# EAGLE design RollerShutterNode_smdnrf (EAGLE 6.5.0)
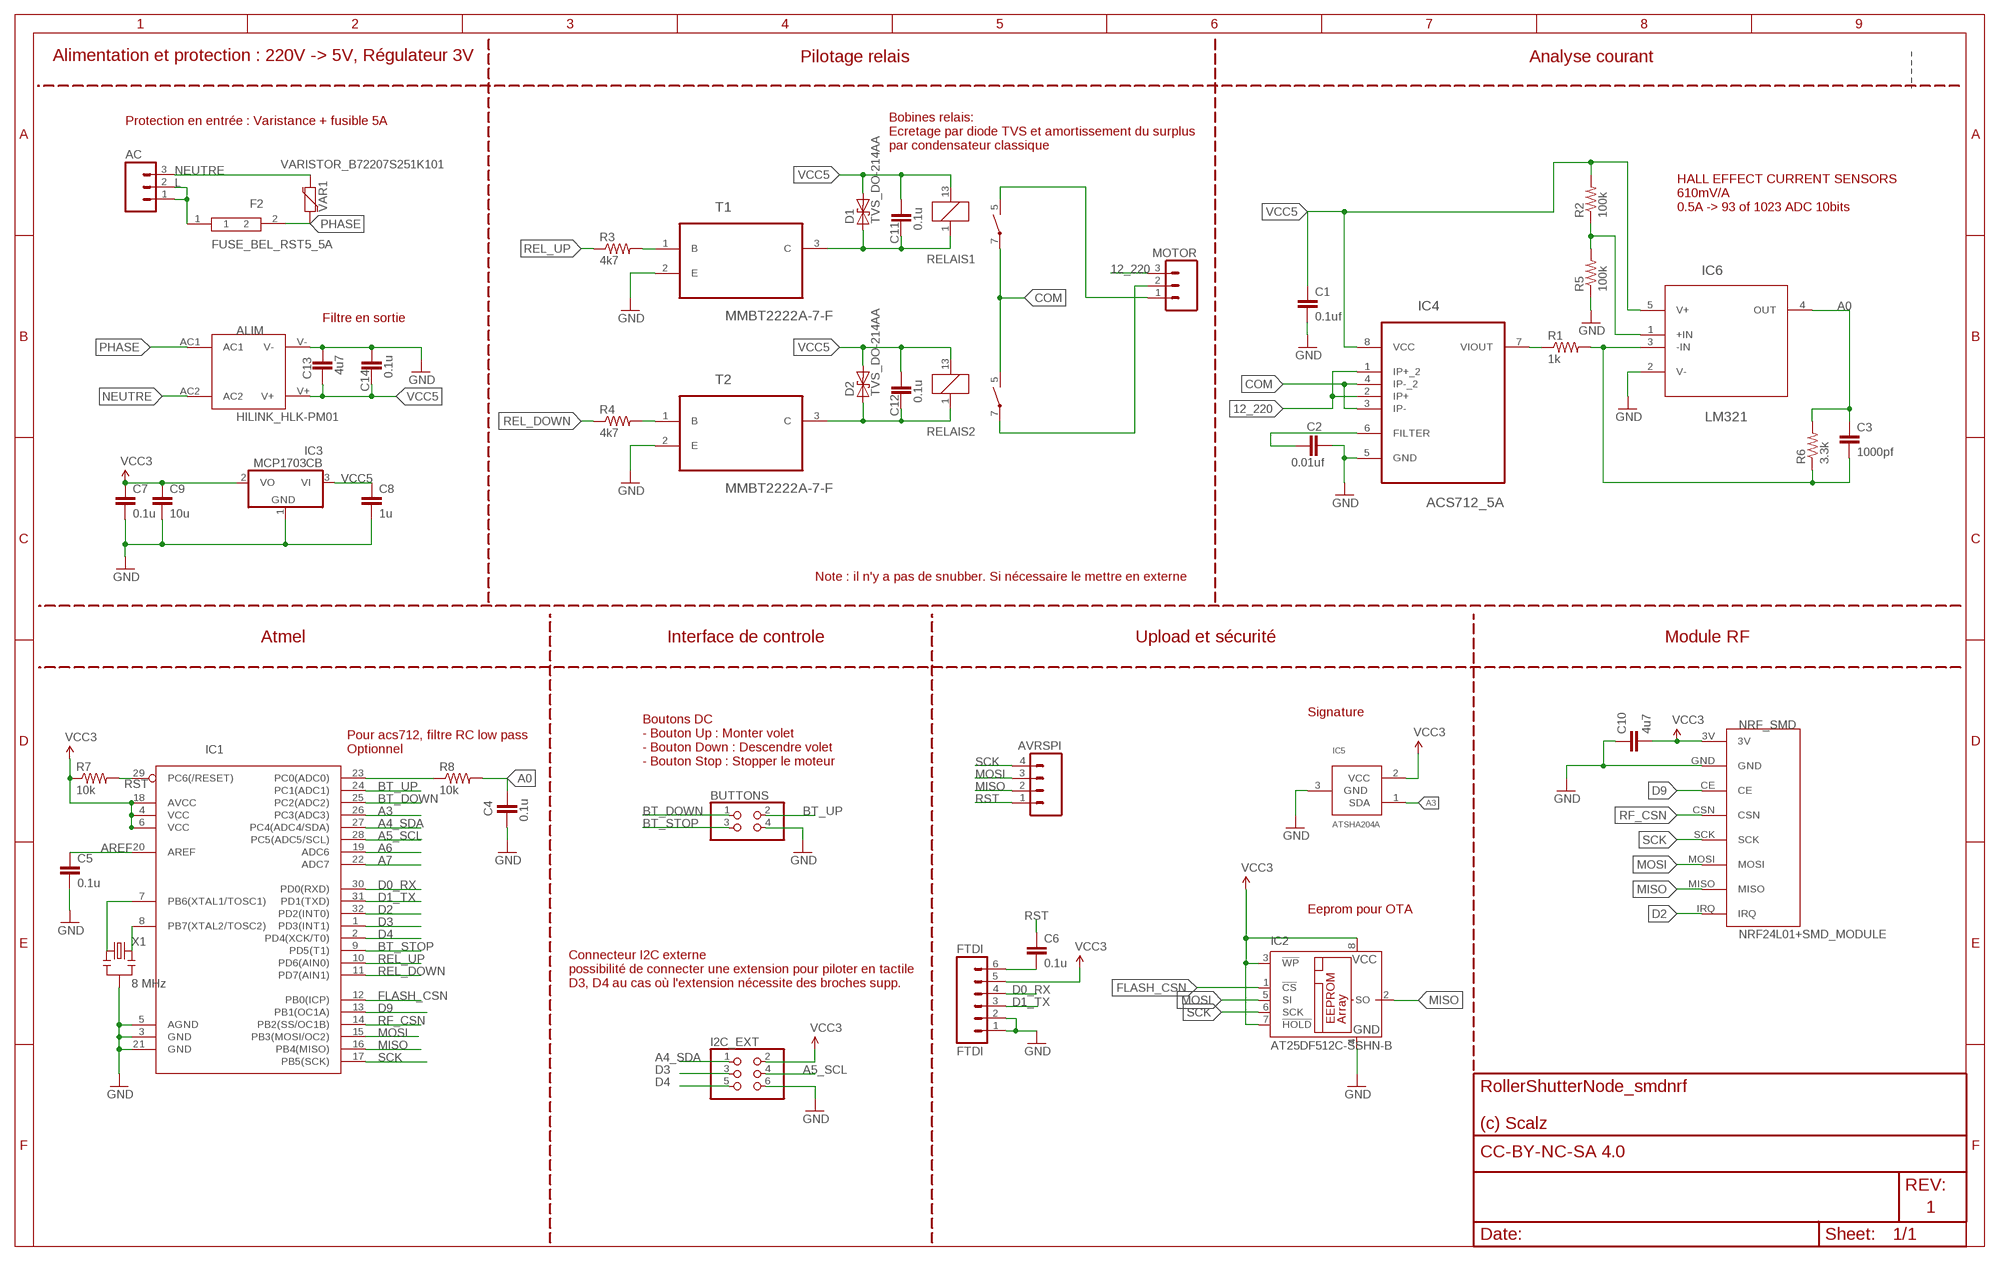
[diagram p0: schematic, sheet 1]

## Parts
AC  M03-SCREW-5MM  [SCREWTERMINAL-5MM-3]
ALIM  HILINK_HLK-PM01  [HILINK_HLK-PM01]
AVRSPI  M04PTH  [1X04]
BUTTONS  PINHD-2X2  [2X02]
C1  0.1uf  CAP0805-CAP  [0805-CAP]
C2  0.01uf  CAP0805-CAP  [0805-CAP]
C3  1000pf  CAP0805-CAP  [0805-CAP]
C4  0.1u  CAP0805-CAP  [0805-CAP]
C5  0.1u  CAP0805-CAP  [0805-CAP]
C6  0.1u  CAP0805-CAP  [0805-CAP]
C7  0.1u  CAP0805-CAP  [0805-CAP]
C8  1u  CAP0805-CAP  [0805-CAP]
C9  10u  CAP0805-CAP  [0805-CAP]
C10  4u7  CAP0805-CAP  [0805-CAP]
C11  0.1u  CAP0805-CAP  [0805-CAP]
C12  0.1u  CAP0805-CAP  [0805-CAP]
C13  4u7  CAP0805-CAP  [0805-CAP]
C14  0.1u  CAP0805-CAP  [0805-CAP]
D1  TVS_DO-214AA  [TVS_DO-214AA]
D2  TVS_DO-214AA  [TVS_DO-214AA]
F2  FUSE_BEL_RST5_5A  [FUSE_BEL_RST5_5A]
FTDI  FTDI  M06SIP  [1X06]
I2C_EXT  PINHD-2X3  [2X03]
IC1  ATMega-328  ATMEGA168/328TQFP32  [TQFP32-08]
IC2  AT25DF512C-SSHN-B  25AA080SN  [SO-08]
IC3  MCP1703CB  [SOT23]
IC4  ACS712_5A  ACS712ELCTR-20A-T  [SOIC127P600X175-8N]
IC5  ATSHA204A  [SOT23]
IC6  LM321  LM321MF  [SOT95P285X120-5N]
MOTOR  M03-SCREW-5MM  [SCREWTERMINAL-5MM-3]
NRF_SMD  NRF24L01+SMD_MODULE  [NRF24L01+SMD_MODULE]
R1  1k  RESISTOR0805-RES  [0805-RES]
R2  100k  RESISTOR0805-RES  [0805-RES]
R3  4k7  RESISTOR0805-RES  [0805-RES]
R4  4k7  RESISTOR0805-RES  [0805-RES]
R5  100k  RESISTOR0805-RES  [0805-RES]
R6  3.3k  RESISTOR0805-RES  [0805-RES]
R7  10k  RESISTOR0805-RES  [0805-RES]
R8  10k  RESISTOR0805-RES  [0805-RES]
RELAIS1  Relais G6D  G6D-1A-ASI12VDC  [G6D]
RELAIS2  Relais G6D  G6D-1A-ASI12VDC  [G6D]
T1  MMBT2222A-7-F  [SOT103P240X110-3N]
T2  MMBT2222A-7-F  [SOT103P240X110-3N]
VAR1  VARISTOR_B72207S251K101  [VARISTOR_B72207S251K101]
X1  8 MHz  RESONATORSMD  [RESONATOR-SMD]

## Nets
12_220: IC4.1(IP+_2) IC4.2(IP+) MOTOR.3
A0: C3.1 C4.2 IC6.4(OUT) R6.2 R8.2
A3: IC1.26(PC3(ADC3)) IC5.1(SDA)
A4_SDA: I2C_EXT.1 IC1.27(PC4(ADC4/SDA))
A5_SCL: I2C_EXT.4 IC1.28(PC5(ADC5/SCL))
A6: IC1.19(ADC6)
A7: IC1.22(ADC7)
AREF: C5.1 IC1.20(AREF)
BT_DOWN: BUTTONS.1 IC1.25(PC2(ADC2))
BT_STOP: BUTTONS.3 IC1.9(PD5(T1))
BT_UP: BUTTONS.2 IC1.24(PC1(ADC1))
COM: IC4.3(IP-) IC4.4(IP-_2) RELAIS1.7(2:P) RELAIS2.5(2:S)
D0_RX: FTDI.4 IC1.30(PD0(RXD))
D1_TX: FTDI.3 IC1.31(PD1(TXD))
D2: IC1.32(PD2(INT0)) NRF_SMD.IRQ
D3: I2C_EXT.3 IC1.1(PD3(INT1))
D4: I2C_EXT.5 IC1.2(PD4(XCK/T0))
D9: IC1.13(PB1(OC1A)) NRF_SMD.CE
FLASH_CSN: IC1.12(PB0(ICP)) IC2.1(!CS)
GND: ALIM.V- BUTTONS.4 C1.2 C2.2 C4.1 C5.2 C7.2 C8.2 C9.2 C10.1 C13.2 C14.2 FTDI.1 FTDI.2 I2C_EXT.6 IC1.3(GND) IC1.5(AGND) IC1.21(GND) IC2.4(GND) IC3.1(GND) IC4.5(GND) IC5.3(GND) IC6.2(V-) NRF_SMD.GND R5.1 T1.2(E) T2.2(E) X1.2
L: AC.1 AC.2 F2.1
MISO: AVRSPI.2 IC1.16(PB4(MISO)) IC2.2(SO) NRF_SMD.MISO
MOSI: AVRSPI.3 IC1.15(PB3(MOSI/OC2)) IC2.5(SI) NRF_SMD.MOSI
N$1: C2.1 IC4.6(FILTER)
N$3: IC4.7(VIOUT) R1.1
N$4: R3.2 T1.1(B)
N$5: R4.2 T2.1(B)
N$6: C12.1 D2.A RELAIS2.1 T2.3(C)
N$7: MOTOR.1 RELAIS1.5(2:S)
N$8: C11.1 D1.A RELAIS1.1 T1.3(C)
N$9: MOTOR.2 RELAIS2.7(2:P)
N$10: C3.2 IC6.3(-IN) R1.2 R6.1
N$11: IC6.1(+IN) R2.1 R5.2
N$12: IC1.7(PB6(XTAL1/TOSC1)) X1.1
N$16: IC1.23(PC0(ADC0)) R8.1
N$20: C6.2 FTDI.6
N$21: IC1.8(PB7(XTAL2/TOSC2)) X1.3
NEUTRE: AC.3 ALIM.AC2 VAR1.1
PHASE: ALIM.AC1 F2.2 VAR1.2
REL_DOWN: IC1.11(PD7(AIN1)) R4.1
REL_UP: IC1.10(PD6(AIN0)) R3.1
RF_CSN: IC1.14(PB2(SS/OC1B)) NRF_SMD.CSN
RST: AVRSPI.1 C6.1 IC1.29(PC6(/RESET)) R7.2
SCK: AVRSPI.4 IC1.17(PB5(SCK)) IC2.6(SCK) NRF_SMD.SCK
VCC: C7.1 C9.1 C10.2 FTDI.5 I2C_EXT.2 IC1.4(VCC) IC1.6(VCC) IC1.18(AVCC) IC2.3(!WP) IC2.7(!HOLD) IC2.8(VCC) IC3.2(VO) IC5.2(VCC) NRF_SMD.3V R7.1 ; supply symbol labelled VCC3
VCC5: ALIM.V+ C1.1 C8.1 C11.2 C12.2 C13.1 C14.1 D1.C D2.C IC3.3(VI) IC4.8(VCC) IC6.5(V+) R2.2 RELAIS1.13 RELAIS2.13

## Notes on the sheet
- Alimentation et protection : 220V -> 5V, Régulateur 3V | Pilotage relais | Analyse courant
- Protection en entrée : Varistance + fusible 5A
- Bobines relais:
  Ecretage par diode TVS et amortissement du surplus
  par condensateur classique
- HALL EFFECT CURRENT SENSORS
  610mV/A
  0.5A -> 93 of 1023 ADC 10bits
- Filtre en sortie
- Note : il n'y a pas de snubber. Si nécessaire le mettre en externe
- Atmel | Interface de controle | Upload et sécurité | Module RF
- Signature
- Pour acs712, filtre RC low pass
  Optionnel
- Boutons DC
  - Bouton Up : Monter volet
  - Bouton Down : Descendre volet
  - Bouton Stop : Stopper le moteur
- Eeprom pour OTA
- Connecteur I2C externe
  possibilité de connecter une extension pour piloter en tactile
  D3, D4 au cas où l'extension nécessite des broches supp.

## Library data of the parts
AC MOTOR = SparkFun-Connectors:M03: Header 3 Standard 3-pin 0.1" header. Use with straight break away headers (SKU : PRT-00116), right angle break away headers (PRT-00553), swiss pins (PRT-00743), machine pins (PRT-00117), and female headers (PRT-00115). Molex polarized connector foot print use with SKU : PRT-08232 with associated crimp pins and housings.
ALIM = pmo_lib:HILINK_HLK-PM01
AVRSPI = SparkFun-Connectors:M04: Header 4 Standard 4-pin 0.1" header. Use with straight break away headers (SKU : PRT-00116), right angle break away headers (PRT-00553), swiss pins (PRT-00743), machine pins (PRT-00117), and female headers (PRT-00115). Molex polarized connector foot print use with SKU : PRT-08231 with associated crimp pins and housings. 1MM SMD Version SKU: PRT-10208
BUTTONS = pinhead:PINHD-2X2: PIN HEADER
C1-C14 = LowPowerLab:CAP: Capacitor Standard 0603 ceramic capacitor, and 0.1" leaded capacitor.
D1 D2 = pmo_lib:TVS_DO-214AA
F2 = pmo_lib:FUSE_BEL_RST5_5A
FTDI = SparkFun-Connectors:M06: Header 6 Standard 6-pin 0.1" header. Use with straight break away headers (SKU : PRT-00116), right angle break away headers (PRT-00553), swiss pins (PRT-00743), machine pins (PRT-00117), and female headers (PRT-00115). Molex polarized connector foot print use with SKU : PRT-08094 with associated crimp pins and housings. NOTES ON THE VARIANTS LOCK and LOCK_LONGPADS... This footprint was designed to help hold the alignment of a through-hole component (i.e. 6-pin header) while soldering it into place. You may notice that each hole has been shifted either up or down by 0.005 of an inch from it's more standard position (which is a perfectly straight line). This slight alteration caused the pins (the squares in the middle) to touch the edges of the holes. Because they are alternating, it causes a "brace" to hold the component in place. 0.005 has proven to be the perfect amount of "off-center" position when using our standard breakaway headers. Although looks a little odd when you look at the bare footprint, once you have a header in there, the alteration is very hard to notice. Also, if you push a header all the way into place, it is covered up entirely on the bottom side. This idea of altering the position of holes to aid alignment will be further integrated into the Sparkfun Library for other footprints. It can help hold any component with 3 or more connection pins.
I2C_EXT = pinhead:PINHD-2X3: PIN HEADER
IC1 = LowPowerLab:ATMEGA168/328: Atmel 32-pin 8-bit micro, 16k flash.; EAGLEUP: TQFP32-08
IC2 = microchip:25*: Serial EEPROM 4K/ 8K , SPI bus; MF: MICROCHIP; MPN: 25AA080/SN; OC_FARNELL: 1816072; OC_NEWARK: 92C7351
IC3 = linear:MCP1703: 250 mA, 16V, Low Quiescent Current LDO Regulator Source: http://ww1.microchip.com/downloads/en/DeviceDoc/22049b.pdf
IC4 = pmo_lib:ACS712ELCTR-20A-T: Linear Current Sensor; MPN: ACS712ELCTR-20A-T; OC_FARNELL: 1329624; OC_NEWARK: 31M3133; PACKAGE: SOIC-8; SUPPLIER: Allegro
IC5 = Sensor_tbowmo:ATSHA204A
IC6 = pmo_lib:LM321MF: Low Power Single Op Amp; MPN: LM321MF; OC_FARNELL: 9779116; OC_NEWARK: 37K8530; PACKAGE: SOT-23-5; SUPPLIER: National Semiconductors
NRF_SMD = pmo_lib:NRF24L01+SMD_MODULE
R1-R8 = LowPowerLab:RESISTOR: Resistor Basic schematic elements and footprints for 0603, 1206, and PTH resistors.
RELAIS1 RELAIS2 = relay:G6D?*: OMRON Slim, Miniature PCB Relay 17.5 × 6.5 × 12.5 mm with Socked Source: http://ecb.omron.com.sg/pdf/relay/power/G6D.pdf
T1 T2 = pmo_lib:MMBT2222A-7-F: NPN SMALL SIGNAL SURFACE MOUNT TRANSISTOR; MPN: MMBT2222A-7-F; OC_FARNELL: 1773626; OC_NEWARK: 51R6809; PACKAGE: SOT-23-3; SUPPLIER: DIODES INC.
VAR1 = pmo_lib:VARISTOR_B72207S251K101
X1 = SparkFun:RESONATOR: Resonator Small SMD resonator. This is the itty bitty 10/20MHz resonators with built in caps. CSTCE10M0G55 and CSTCE20M0V53. Footprint has been reviewed closely but hasn't been tested yet.

## Net classes
1 Power: width 0.406 mm

## Board
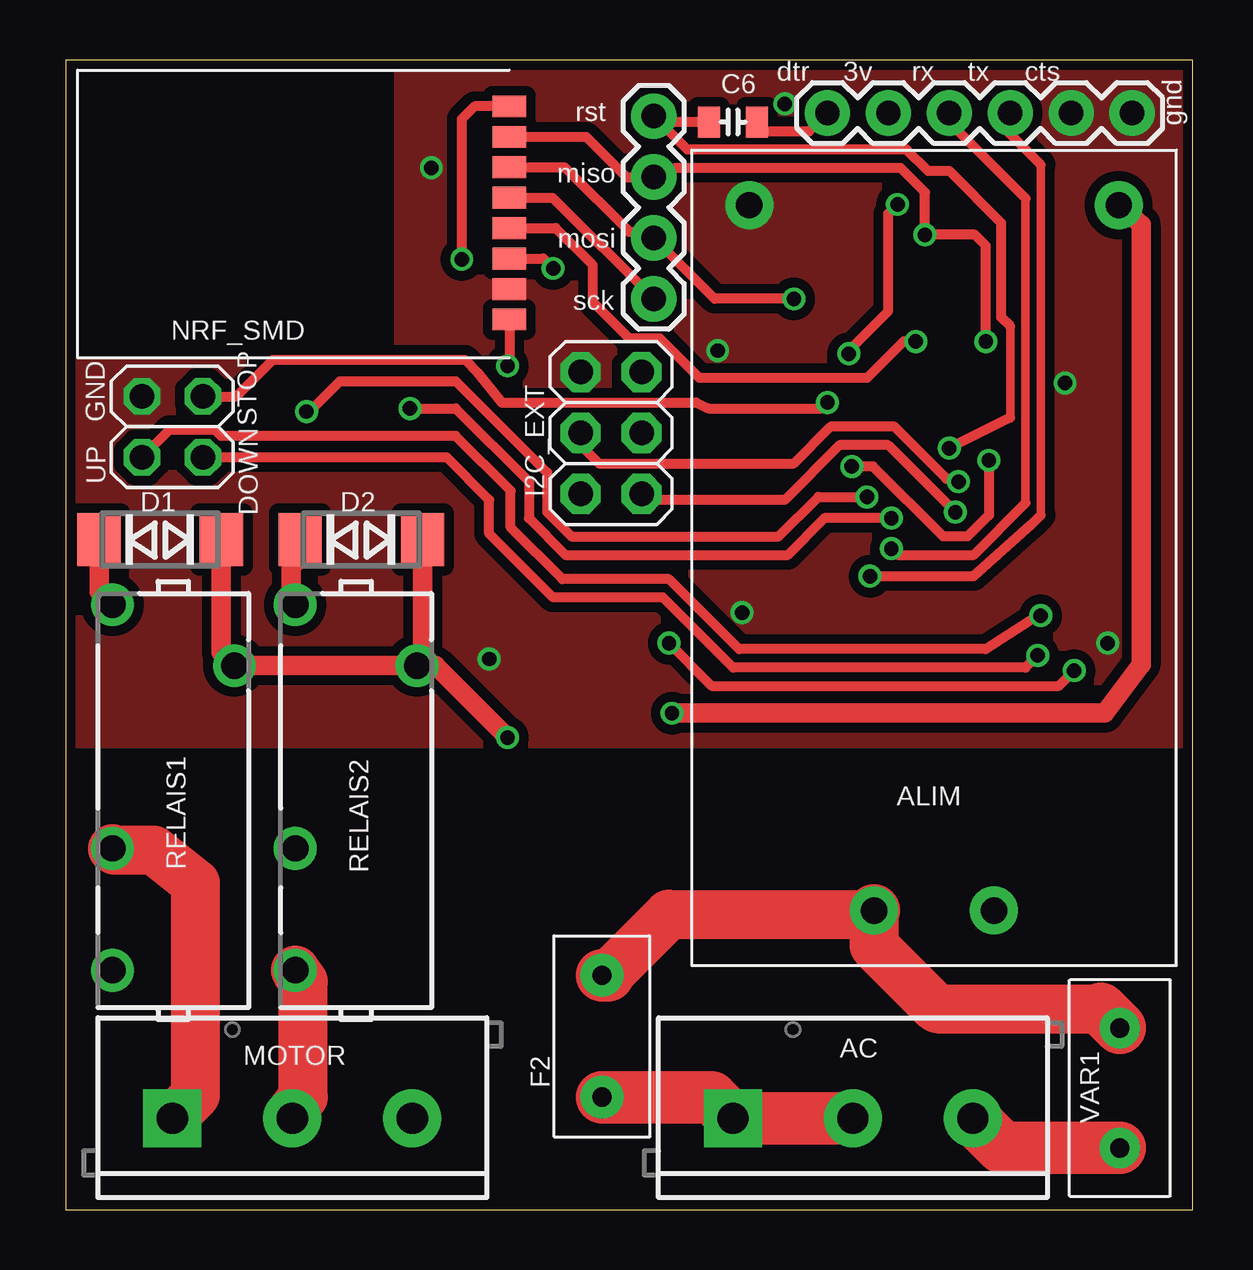
[diagram p1: board, top side]
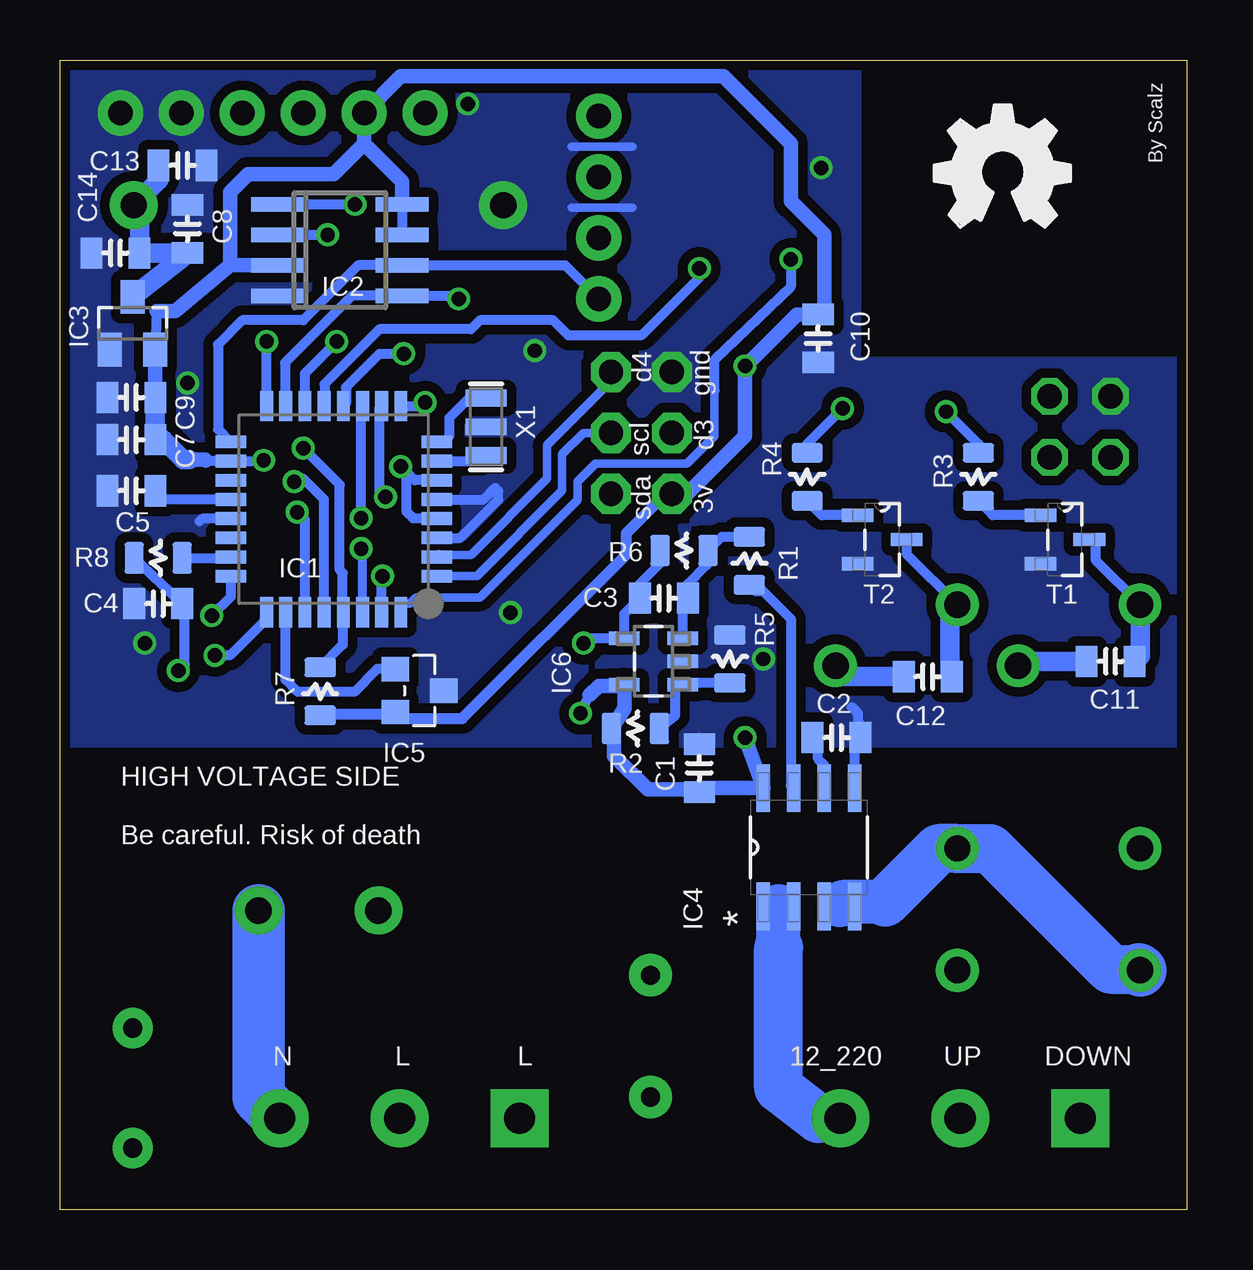
[diagram p2: board, bottom side, seen from below]

Size 46.97 x 47.93 mm. Coordinates in mm from the lower left corner, seen from the top.
Outline: 0,0 46.97,0 46.97,47.93 0,47.93 0,0
Copper layers (1*16): Top 0.0356mm / dielectric 1.5011mm / Bottom 0.0356mm
Design rules "LaenPCBOrder": minimum track width 6mil, minimum drill 13mil, track to track 6mil, track to pad 6mil, pad to pad 6mil, via to via 6mil, smd to smd 6mil, copper to edge 15mil, drill to drill 6mil, minimum pad ring 7mil, minimum via ring 7mil, stop-mask expansion 3mil, vias tented up to drill 0mil, thermal gap 10mil

### Footprints (pad centres in the part's own frame; a part is rotated, then mirrored left to right if it is on the bottom)
SCREWTERMINAL-5MM-3 = drill 1.3 pad 2.413 square: 1 0,0 | drill 1.3 pad 2.413: 2 5,0; 3 10,0
HILINK_HLK-PM01 = drill 1.1 pad 2: AC1 2.5,14.7; AC2 -2.5,14.7; V+ -7.7,-14.7; V- 7.7,-14.7
1X04 = drill 1.016 pad 1.88: 1 0,0; 2 2.54,0; 3 5.08,0; 4 7.62,0
2X02 = drill 1.016 octagon: 1 -1.27,-1.27; 2 -1.27,1.27; 3 1.27,-1.27; 4 1.27,1.27
0805-CAP = smd 0.902 x 1.3: 1 -1,0; 2 1,0
TVS_DO-214AA = smd 1.8 x 2.2: A 2.55,0; C -2.55,0
FUSE_BEL_RST5_5A = drill 0.8 pad 1.778: 1 -2.54,0; 2 2.54,0
1X06 = drill 1.016 pad 1.88: 1 0,0; 2 2.54,0; 3 5.08,0; 4 7.62,0; 5 10.16,0; 6 12.7,0
2X03 = drill 1.016 pad 1.676 octagon: 1 -2.54,-1.27; 2 -2.54,1.27; 3 0,-1.27; 4 0,1.27; 5 2.54,-1.27; 6 2.54,1.27
TQFP32-08 = smd 1.27 x 0.533: 1 -4.293,2.8; 2 -4.293,2; 3 -4.293,1.2; 4 -4.293,0.4; 5 -4.293,-0.4; 6 -4.293,-1.2; 7 -4.293,-2; 8 -4.293,-2.8; 17 4.293,-2.8; 18 4.293,-2; 19 4.293,-1.2; 20 4.293,-0.4; 21 4.293,0.4; 22 4.293,1.2; 23 4.293,2; 24 4.293,2.8 | smd 0.533 x 1.27: 9 -2.8,-4.293; 10 -2,-4.293; 11 -1.2,-4.293; 12 -0.4,-4.293; 13 0.4,-4.293; 14 1.2,-4.293; 15 2,-4.293; 16 2.8,-4.293; 25 2.8,4.293; 26 2,4.293; 27 1.2,4.293; 28 0.4,4.293; 29 -0.4,4.293; 30 -1.2,4.293; 31 -2,4.293; 32 -2.8,4.293
SO-08 = smd 0.6 x 2.2: 1 -1.905,-2.6; 2 -0.635,-2.6; 3 0.635,-2.6; 4 1.905,-2.6; 5 1.905,2.6; 6 0.635,2.6; 7 -0.635,2.6; 8 -1.905,2.6
SOT23 = smd 1 x 1.4: 1 -0.95,-1.1; 2 0.95,-1.1; 3 0,1.1
SOIC127P600X175-8N = smd 1.981 x 0.559: 1 -2.464,1.905; 2 -2.464,0.635; 3 -2.464,-0.635; 4 -2.464,-1.905; 5 2.464,-1.905; 6 2.464,-0.635; 7 2.464,0.635; 8 2.464,1.905
SOT23' = smd 1.016 x 1.143: 1 -0.889,-1.016; 2 0.889,-1.016; 3 0,1.016
SOT95P285X120-5N = smd 1.27 x 0.559: 1 -1.219,0.965; 2 -1.219,0; 3 -1.219,-0.965; 4 1.219,-0.965; 5 1.219,0.965
NRF24L01+SMD_MODULE = smd 0.9 x 1.4: 3V -4.8,-9.6; CE -2.26,-9.6; CSN -0.99,-9.6; GND -3.53,-9.6; IRQ 4.09,-9.6; MISO 2.82,-9.6; MOSI 1.55,-9.6; SCK 0.28,-9.6
0805-RES = smd 0.8 x 1.3: 1 -1,0; 2 1,0
G6D = drill 1.1 pad 1.778: 1 8.08,2.5; 5 -2.08,2.5; 7 -7.16,2.5; 13 5.54,-2.58
SOT103P240X110-3N = smd 1.321 x 0.559: 1 -1.016,1.016; 2 -1.016,-1.016; 3 1.016,0
VARISTOR_B72207S251K101 = drill 0.8 pad 1.676: 1 -2.5,0; 2 2.5,0
RESONATOR-SMD = smd 0.7 x 1.7: 1 -1.2,0; 2 0,0; 3 1.2,0

### Placement (x,y rotation side)
AC  27.81,3.81 0 top
ALIM  36.2,27.18 180 top
AVRSPI  24.51,45.59 270 top
BUTTONS  4.45,32.64 90 top
C1  20.32,18.41 90 bottom
C2  14.61,19.68 0 bottom
C3  21.79,25.5 0 bottom
C4  42.88,25.27 0 bottom
C5  43.99,29.97 180 bottom
C6  27.81,45.34 0 top
C7  43.99,32.11 180 bottom
C8  41.66,40.89 90 bottom
C9  43.99,33.86 180 bottom
C10  15.37,36.32 90 bottom
C11  3.17,22.86 180 bottom
C12  10.79,22.23 180 bottom
C13  41.86,43.54 0 bottom
C14  44.65,39.88 180 bottom
D1  3.94,27.94 180 top
D2  12.32,27.94 180 top
F2  22.35,7.24 90 top
FTDI  44.45,45.72 180 top
I2C_EXT  22.73,32.38 90 top
IC1  35.56,29.21 180 bottom
IC2  35.31,40.01 270 bottom
IC3  43.94,36.96 0 bottom
IC4  15.75,15.11 90 bottom
IC5  ATSHA204A  [SOT23']  31.98,21.64 270 bottom
IC6  22.23,22.86 180 bottom
MOTOR  4.45,3.81 0 top
NRF_SMD  8.89,41.91 90 top
R1  18.24,27.05 90 bottom
R2  22.99,20.07 180 bottom
R3  8.69,30.56 270 bottom
R4  15.82,30.56 270 bottom
R5  19.05,22.96 270 bottom
R6  20.95,27.48 180 bottom
R7  36.12,21.62 90 bottom
R8  42.88,27.18 180 bottom
RELAIS1  4.45,17.14 90 top
RELAIS2  12.06,17.14 90 top
T1  5.08,27.94 0 bottom
T2  12.7,27.94 0 bottom
U$4  [OSHW_FILLX200_NOTEXT]  10.52,40.97 0 bottom
VAR1  43.94,5.08 90 top
X1  29.21,32.64 90 bottom

### Tracks (layer width: path | path; a pad name or v marks a point on that pad's centre or on a via)
12_220
  Bottom 0.406: IC4.1 17.02,12.65 IC4.2
  Bottom 1.829: 17.02,10.92 17.02,12.65
  Bottom 2.032: MOTOR.3 15.37,3.81 17.02,5.08 17.02,10.92
A0  (via drill 0.6)
  Top 0.406: v25.15,23.62 26.92,21.84 41.4,21.84 v42.04,22.48
  Bottom 0.406: v25.15,23.62 24.94,23.82 IC6.4 23.44,24.85 C3.1 22.79,26.1 21.97,26.92 21.97,27.47 R6.2 | v42.04,22.48 41.77,22.74 41.77,25.15 C4.2 41.98,25.38 R8.2
A3
  Bottom 0.406: 37.59,24.89 IC1.26 37.57,22.1 37.06,21.59 34.7,21.59 33.73,22.55 33.02,22.55 IC5.1
A4_SDA  (via drill 0.6)
  Top 0.406: v37.08,29.08 34.29,31.88 32.26,31.88 29.97,29.59 24.26,29.59 I2C_EXT.1
  Bottom 0.406: IC1.27 36.76,28.76 v37.08,29.08
A5_SCL  (via drill 0.6)
  Top 0.406: v37.21,30.35 37.08,30.48 36.7,30.48 34.54,32.64 31.88,32.64 30.35,31.11 22.23,31.11 21.46,31.88 I2C_EXT.4
  Bottom 0.406: IC1.28 35.96,29.61 36.83,30.48 v37.21,30.35
AREF
  Bottom 0.406: IC1.20 42.83,29.61 C5.1
BT_DOWN  (via drill 0.6)
  Top 0.406: BUTTONS.1 15.88,31.37 17.65,29.59 17.65,28.19 20.32,25.53 24.89,25.53 27.81,22.61 40.01,22.61 v40.51,23.11
  Bottom 0.406: IC1.25 38.36,24.5 38.49,24.5 39.88,23.11 v40.51,23.11
BT_STOP  (via drill 0.6)
  Top 0.406: BUTTONS.3 7.11,33.91 8.64,35.43 16.64,35.43 17.14,34.92 18.16,33.66 26.29,33.66 26.8,33.4 31.5,33.4 v31.75,33.66
  Bottom 0.406: IC1.9 31.9,33.5 v31.75,33.66
BT_UP  (via drill 0.6)
  Top 0.406: BUTTONS.2 4.32,32.51 6.22,32.51 6.48,32.26 16.26,32.26 18.54,29.97 18.54,28.45 20.7,26.29 25.15,26.29 28.07,23.37 38.35,23.37 40.51,24.77 v40.64,24.77
  Bottom 0.406: IC1.24 39.85,25.55 v40.64,24.77
COM
  Bottom 0.406: IC4.3 IC4.4 14.02,12.83 14.35,12.83
  Bottom 1.829: 12.57,12.83 14.35,12.83 14.48,12.7
  Bottom 2.032: 12.57,12.83 10.34,15.06 RELAIS2.5 8.21,15.06 3.17,10.03 1.99,10.03
  Bottom 2.184: 1.99,10.03 RELAIS1.7
D0_RX  (via drill 0.6)
  Top 0.356: 40.01,42.16 40.01,29.46
  Top 0.406: 40.01,29.46 37.85,27.3 34.67,27.3 v34.42,27.56 | 40.01,42.16 36.96,45.21 36.96,45.59 FTDI.4
  Bottom 0.381: IC1.30 34.36,27.5
  Bottom 0.406: 34.36,27.5 v34.42,27.56
D1_TX  (via drill 0.6)
  Top 0.356: 40.64,28.96 40.64,43.56
  Top 0.406: v33.53,26.42 37.85,26.42 40.26,28.57 40.64,28.96 | 40.64,43.56 39.24,44.96 39.24,45.72 FTDI.3
  Bottom 0.406: IC1.31 33.56,26.32 v33.53,26.42
D2  (via drill 0.6)
  Top 0.406: NRF_SMD.IRQ 17.04,46 16.51,45.47 v16.51,39.62
  Bottom 0.356: 32.76,25.28 32.38,25.28 32.13,25.53 29.46,25.53 25.4,29.59 25.4,30.35 24.64,31.11 20.83,31.11 19.68,32.26 19.68,34.16
  Bottom 0.406: IC1.32 32.76,25.28 | 19.68,34.16 19.68,35.43 16.51,38.48 v16.51,39.62
D3
  Bottom 0.356: IC1.1 29.59,26.42 26.04,29.97 26.04,31.5 25.15,32.38 I2C_EXT.3
  Bottom 0.406: IC1.1
D4
  Bottom 0.356: 31.17,27.3 29.84,27.3 26.67,30.48 26.67,31.88 24,34.54 I2C_EXT.5
  Bottom 0.406: 31.17,27.3 IC1.2
D9  (via drill 0.6)
  Top 0.406: NRF_SMD.CE 19.91,39.65 v20.32,39.24
  Bottom 0.406: IC1.13 35.94,33.52 35.94,34.42 33.66,36.7 29.84,36.7 29.46,37.08 26.42,37.08 25.78,36.45 22.73,36.45 20.32,38.86 v20.32,39.24
FLASH_CSN  (via drill 0.6)
  Top 0.406: v32.64,35.69 32.64,35.81 34.29,37.47 34.29,41.53 v34.67,41.91
  Bottom 0.406: IC2.1 v34.67,41.91 | IC1.12 35.05,33.61 35.05,34.29 33.66,35.69 v32.64,35.69
GND  (via drill 0.6)
  Bottom 0.356: 23.11,44.32 25.65,44.32 | 23.11,41.78 25.65,41.78
  Bottom 0.406: C1.2 20.32,19.68 | 13.97,20.95 13.71,20.69 C2.2 13.84,19.55 IC4.5 | IC1.3 30.28,28.01 28.7,29.59 28.7,29.97 | IC1.5 29.32,29.61 28.83,30.1 | IC1.21 41.04,28.81 41.15,28.7
  other vias: 41.66,34.47 28.19,24.89 17.65,22.96 15.24,43.43 27.18,35.81 43.43,23.62 29.97,46.1
  pour Top (isolate 0.406, rank 6, no thermals): -5.08,52.07 50.8,52.07 50.8,-5.08 -5.08,-5.08
  pour Bottom (isolate 0.406, rank 6, no thermals): -2.54,49.53 49.53,49.53 49.53,-2.54 -2.54,-2.54
L
  Top 2.184: F2.1 26.92,4.7 AC.1 AC.2
MISO  (via drill 0.6)
  Top 0.406: v38.35,36.2 38.35,40.19 IC2.2 v35.81,40.64 35.81,42.42 34.8,43.43 25.4,43.43 25.02,43.05 AVRSPI.2 23.37,43.05 21.69,44.73 NRF_SMD.MISO
  Bottom 0.406: IC2.2 v35.81,40.64 | IC1.16 38.36,34.55 v38.35,36.2
MOSI  (via drill 0.6)
  Top 0.406: NRF_SMD.MOSI 20.8,43.46 23.5,40.77 24.26,40.77 AVRSPI.3 27.05,37.97 v30.35,37.97
  Bottom 0.406: IC1.15 37.59,33.53 37.59,35.31 34.8,38.1 IC2.5 30.48,38.1 v30.35,37.97
N$1
  Bottom 0.406: IC4.6 15.11,18.54 15.37,18.8 15.37,19.55 C2.1
N$2
  cutout Top (no thermals): 0,19.05 46.99,19.05 46.99,0 0,0
N$3
  Bottom 0.406: IC4.7 16.51,17.7 16.51,24.64 17.65,25.78 17.97,25.78 R1.1
N$4
  Bottom 0.406: T1.1 8.09,28.96 R3.2
N$5
  Bottom 0.406: T2.1 15.22,28.96 R4.2
N$6
  Top 0.406: D2.A 10.15,27.3
  Top 0.813: 10.15,27.3 9.9,27.3 9.4,26.8 9.4,25.39 RELAIS2.1
  Bottom 0.406: T2.3 11.68,27.34 RELAIS2.1
  Bottom 0.813: RELAIS2.1 9.56,25.11 9.88,24.79 9.88,22.31 C12.1
N$7
  Top 2.032: RELAIS1.5 2.02,14.99 3.68,14.99 5.41,13.61 5.41,4.78 MOTOR.1
N$8
  Top 0.813: D1.A 1.39,25.78 RELAIS1.1
  Bottom 0.406: T1.3 3.81,27.94 3.81,27.09 RELAIS1.1
  Bottom 0.813: RELAIS1.1 1.95,23.09 C11.1
N$9
  Top 2.032: MOTOR.2 9.45,4.11 9.91,4.7 9.91,9.52 RELAIS2.7
N$10
  Bottom 0.406: IC6.3 21.01,25.29 C3.2 20.79,26.09 20.02,26.87 20.02,27.42 R6.1 19.39,28.05 R1.2
N$11
  Bottom 0.406: R5.2 20.94,21.96 IC6.1 21.16,21.89 21.34,21.72 21.34,20.59 R2.1
N$12
  Bottom 0.406: IC1.7 29.44,31.21 X1.1
N$13
  cutout Bottom (rank 2, no thermals): -1.27,19.05 46.99,19.05 46.99,0 -1.27,0
N$14
  cutout Top (no thermals): 0,48.26 13.46,48.26 13.46,35.69 0,35.69
N$15
  cutout Bottom (no thermals): -1.27,48.26 13.46,48.26 13.46,35.69 -1.27,35.69
N$16
  Bottom 0.406: R8.1 39.88,27.18 IC1.23
N$20
  Top 0.406: C6.2 28.81,45.23 29.08,44.96 30.99,44.96 FTDI.6
N$21
  Bottom 0.406: IC1.8 30.98,32.01 30.73,32.26 30.73,33.02 29.97,33.78 29.27,33.78 X1.3
NEUTRE
  Top 2.184: VAR1.1 39.04,2.58 AC.3
  Bottom 2.184: ALIM.AC2 38.7,4.69 AC.3
PHASE
  Top 2.032: 22.61,9.78 25.15,12.32 33.41,12.32 | ALIM.AC1 33.7,11.01 36.32,8.38 43.14,8.38
  Top 2.184: F2.2 22.61,9.78 | 33.41,12.32 ALIM.AC1 | 43.14,8.38 VAR1.2
REL_DOWN  (via drill 0.6)
  Top 0.406: v34.42,28.83 31.62,28.83 30.1,27.3 20.83,27.3 19.3,28.83 19.3,30.35 16.26,33.4 v14.35,33.4
  Bottom 0.406: v34.42,28.83 34.42,33.45 IC1.11 | R4.1 15.82,31.93 v14.35,33.4
REL_UP  (via drill 0.6)
  Top 0.406: v33.4,29.72 31.37,29.72 29.72,28.07 21.08,28.07 20.07,29.08 20.07,30.73 16.26,34.54 11.43,34.54 10.29,33.4 10.29,33.27 v10.03,33.27
  Bottom 0.406: IC1.10 33.66,33.41 33.66,29.97 v33.4,29.72 | R3.1 8.69,31.93 v10.03,33.27
RF_CSN  (via drill 0.6)
  Top 0.406: NRF_SMD.CSN 20.42,40.92 21.97,39.37 21.97,37.85 23.5,36.32 24.77,36.32 26.42,34.67 33.4,34.67 34.92,36.2 v35.43,36.2
  Bottom 0.406: 35.62,36.01 v35.43,36.2 36.76,34.87 IC1.14
RST  (via drill 0.6)
  Top 0.356: 39.37,36.83 39.37,33.02
  Top 0.406: 39.37,36.83 38.99,37.21 38.99,41.15 36.83,43.31 35.94,43.31 35.05,44.2 25.91,44.2 AVRSPI.1 24.77,45.34 C6.1 | 39.37,33.02 v36.83,31.75
  Bottom 0.406: 35.18,24.9 IC1.29 | 35.18,24.9 35.18,26.54 35.31,26.67 35.31,30.23 v36.83,31.75 | 35.18,24.9 35.18,23.55 R7.2
SCK
  Top 0.406: NRF_SMD.SCK 20.29,42.19 AVRSPI.4
  Bottom 0.406: 39.88,32.03 IC1.17 40.39,32.54 40.39,36.07 39.37,37.08 36.83,37.08 34.54,39.37 IC2.6 25.91,39.37 AVRSPI.4
VCC  (via drill 0.6)
  Top 0.406: NRF_SMD.3V 18.49,35.25 v18.41,35.18 | v38.48,31.24 38.48,28.96 37.59,28.07 36.58,28.07 33.66,30.99 v32.77,30.99
  Bottom 0.406: 40.89,31.24 39.88,31.24 IC1.18 38.51,31.21 v38.48,31.24 | IC2.8 IC2.7 | 42.95,37.47 IC3.2 | IC1.6 32.19,30.41 v32.77,30.99 32.51,30.61 32.51,29.08 32.26,28.83 31.29,28.83 IC1.4
  Bottom 0.457: 21.97,29.59 23.37,28.19 23.37,27.3 30.2,20.47 32.51,20.47 32.79,20.75 IC5.2 33.1,20.65 36.08,20.65
  Bottom 0.61: 42.95,37.47 42.16,37.47 39.88,39.37 | IC3.2 C9.1 | 21.97,29.59 I2C_EXT.2 21.84,29.72 20.95,29.72 18.41,32.26 v18.41,35.18 18.39,35.18 16.26,37.31 C10.2 15.11,37.48 15.11,40.64 16.51,42.04 16.51,44.45 19.3,47.24 32.77,47.24 FTDI.5 34.29,44.45 | 34.29,44.45 35.56,43.18 39.12,43.18 39.88,42.42 39.88,39.37 | IC2.8 32.71,42.87 34.29,44.45 | 39.88,39.37 IC2.3 | 36.08,20.65 R7.1 | 41.58,31.27 40.92,31.27 40.89,31.24
  Bottom 0.813: C9.1 C7.1 42.67,32.11 41.83,31.27 41.58,31.27
VCC5  (via drill 0.6)
  Top 0.406: RELAIS2.13 15.41,22.68
  Top 0.813: 15.41,22.68 v18.41,19.68 | D1.C 6.49,23.22 RELAIS1.13 RELAIS2.13 14.87,22.91 D2.C | v25.27,20.7 43.31,20.7 44.83,22.73 44.83,41.07 ALIM.V+
  Bottom 0.406: v25.27,20.7 24.89,21.46 | 23.5,21.84 IC6.5 | 23.88,20.05 R2.2 | 20.26,17.58 C1.1
  Bottom 0.61: v18.41,19.68 IC4.8 20.26,17.58 | 24.89,21.46 24.51,21.84 23.5,21.84 | IC6.5 23.44,20.89 R2.2 | 23.88,20.05 23.88,18.92 22.47,17.52 20.42,17.52 C1.1
  Bottom 0.813: C11.2 6.85,22.86 RELAIS1.13 | C12.2 14.19,22.23 RELAIS2.13 | 43.94,41.96 ALIM.V+ | IC3.3 42.05,39.55 | 42.05,39.55 41.84,39.71 C8.1 | C13.1 42.86,42.91 ALIM.V+ | ALIM.V+ 43.65,41.64 C14.1 42.38,39.88 42.05,39.55

### Text on the board
tPlace: dtr | 3v | rx | tx | cts | gnd | rst | miso | mosi | sck | STOP | GND | DOWN | UP
bPlace: By Scalz | d4 | gnd | d3 | scl | 3v | sda | HIGH VOLTAGE SIDE / / Be careful. Risk of death | DOWN | UP | 12_220 | L | L | N
Document: C:/Users/Pascal/Desktop/oshw_product_page.bmp
200bmp: C:/Users/Pascal/Desktop/oshw_product_page.bmp